# EAGLE design Rear Lamp (EAGLE 8.2.2)
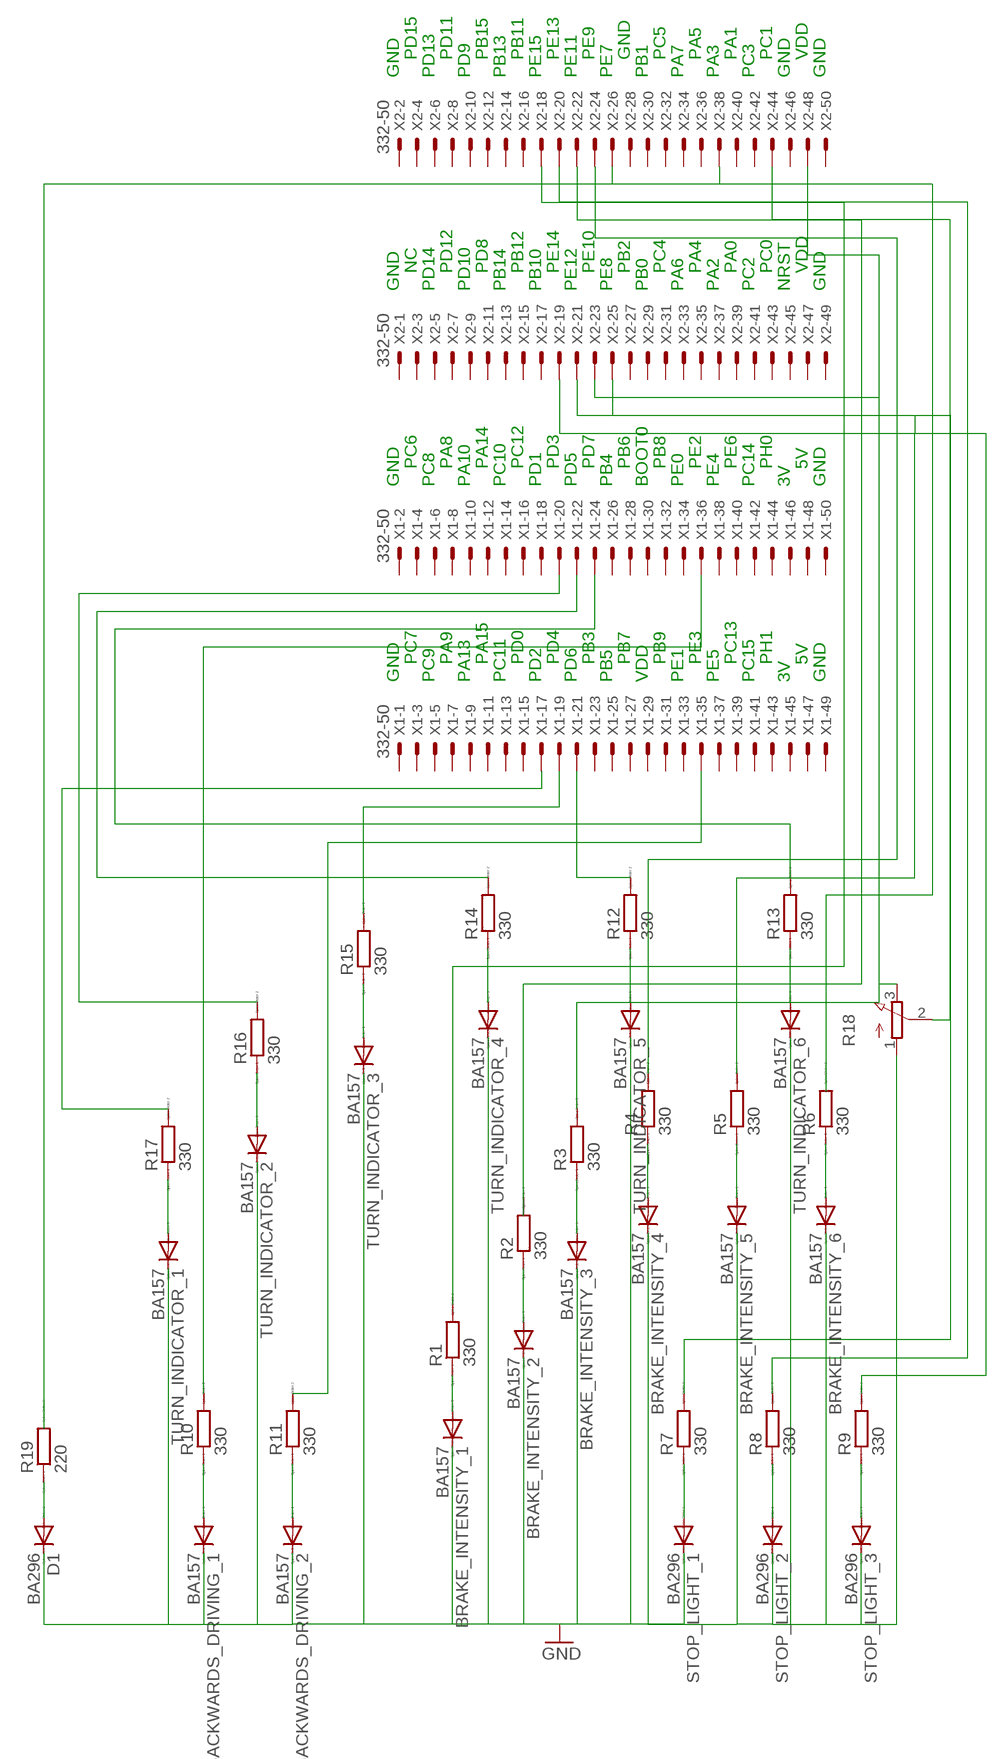
[diagram p0: schematic, sheet 1]

## Parts
BACKWARDS_DRIVING_1  BA157  [P1-10]
BACKWARDS_DRIVING_2  BA157  [P1-10]
BRAKE_INTENSITY_1  BA157  [P1-10]
BRAKE_INTENSITY_2  BA157  [P1-10]
BRAKE_INTENSITY_3  BA157  [P1-10]
BRAKE_INTENSITY_4  BA157  [P1-10]
BRAKE_INTENSITY_5  BA157  [P1-10]
BRAKE_INTENSITY_6  BA157  [P1-10]
D1  BA296  [P2-15]
R1  330  R0204/7  [0204/7]
R2  330  R0204/7  [0204/7]
R3  330  R0204/7  [0204/7]
R4  330  R0204/7  [0204/7]
R5  330  R0204/7  [0204/7]
R6  330  R0204/7  [0204/7]
R7  330  R0204/7  [0204/7]
R8  330  R0204/7  [0204/7]
R9  330  R0204/7  [0204/7]
R10  330  R0204/7  [0204/7]
R11  330  R0204/7  [0204/7]
R12  330  R0204/7  [0204/7]
R13  330  R0204/7  [0204/7]
R14  330  R0204/7  [0204/7]
R15  330  R0204/7  [0204/7]
R16  330  R0204/7  [0204/7]
R17  330  R0204/7  [0204/7]
R18  3RP/1610N  [3RP/1610N]
R19  220  R0204/7  [0204/7]
STOP_LIGHT_1  BA296  [P2-15]
STOP_LIGHT_2  BA296  [P2-15]
STOP_LIGHT_3  BA296  [P2-15]
TURN_INDICATOR_1  BA157  [P1-10]
TURN_INDICATOR_2  BA157  [P1-10]
TURN_INDICATOR_3  BA157  [P1-10]
TURN_INDICATOR_4  BA157  [P1-10]
TURN_INDICATOR_5  BA157  [P1-10]
TURN_INDICATOR_6  BA157  [P1-10]
X1  332-50  [332-50]
X2  332-50  [332-50]

## Nets
N$1: BRAKE_INTENSITY_1.A R1.1
N$2: BRAKE_INTENSITY_2.A R2.1
N$3: BRAKE_INTENSITY_3.A R3.1
N$4: BRAKE_INTENSITY_4.A R4.1
N$5: BRAKE_INTENSITY_5.A R5.1
N$6: BRAKE_INTENSITY_6.A R6.1
N$7: R7.1 STOP_LIGHT_1.A
N$8: R8.1 STOP_LIGHT_2.A
N$9: R9.1 STOP_LIGHT_3.A
N$10: BACKWARDS_DRIVING_1.A R10.1
N$11: BACKWARDS_DRIVING_2.A R11.1
N$12: R12.1 TURN_INDICATOR_5.A
N$13: R13.1 TURN_INDICATOR_6.A
N$14: R14.1 TURN_INDICATOR_4.A
N$15: R15.1 TURN_INDICATOR_3.A
N$16: R16.1 TURN_INDICATOR_2.A
N$17: R17.1 TURN_INDICATOR_1.A
N$18: R17.2 X1.17
N$19: D1.A R19.1
N$20: R16.2 X1.20
N$21: R15.2 X1.19
N$22: R14.2 X1.22
N$23: R12.2 X1.21
N$24: R13.2 X1.24
N$25: R10.2 X1.36
N$26: R11.2 X1.35
N$27: X2.38
N$28: R1.2 X2.18
N$29: X2.22
N$30: X2.26
N$31: R3.2 X2.23
N$32: R4.2 X2.24
N$33: R5.2 X2.25
N$34: R7.2 X2.21
N$35: R8.2 X2.20
N$36: R9.2 X2.19
N$37: R18.2(S) X2.44
N$38: R18.3(E) X2.48
N$39: BACKWARDS_DRIVING_1.C BACKWARDS_DRIVING_2.C BRAKE_INTENSITY_1.C BRAKE_INTENSITY_2.C BRAKE_INTENSITY_3.C BRAKE_INTENSITY_4.C BRAKE_INTENSITY_5.C BRAKE_INTENSITY_6.C D1.C R18.1(A) STOP_LIGHT_1.C STOP_LIGHT_2.C STOP_LIGHT_3.C TURN_INDICATOR_1.C TURN_INDICATOR_2.C TURN_INDICATOR_3.C TURN_INDICATOR_4.C TURN_INDICATOR_5.C TURN_INDICATOR_6.C
Unconnected: R2.2 R6.2 R19.2 X1.1 X1.2 X1.3 X1.4 X1.5 X1.6 X1.7 X1.8 X1.9 X1.10 X1.11 X1.12 X1.13 X1.14 X1.15 X1.16 X1.18 X1.23 X1.25 X1.26 X1.27 X1.28 X1.29 X1.30 X1.31 X1.32 X1.33 X1.34 X1.37 X1.38 X1.39 X1.40 X1.41 X1.42 X1.43 X1.44 X1.45 X1.46 X1.47 X1.48 X1.49 X1.50 X2.1 X2.2 X2.3 X2.4 X2.5 X2.6 X2.7 X2.8 X2.9 X2.10 X2.11 X2.12 X2.13 X2.14 X2.15 X2.16 X2.17 X2.27 X2.28 X2.29 X2.30 X2.31 X2.32 X2.33 X2.34 X2.35 X2.36 X2.37 X2.39 X2.40 X2.41 X2.42 X2.43 X2.45 X2.46 X2.47 X2.49 X2.50

## Notes on the sheet
- PD15 | PD11 | PB15 | PB11 | PE13 | PE9 | GND | PC5 | PA5 | PA1 | PC1 | VDD
- GND | PD13 | PD9 | PB13 | PE15 | PE11 | PE7 | PB1 | PA7 | PA3 | PC3 | GND | GND
- NC | PD12 | PD8 | PB12 | PE14 | PE10 | PB2 | PC4 | PA4 | PA0 | PC0 | VDD
- GND | PD14 | PD10 | PB14 | PB10 | PE12 | PE8 | PB0 | PA6 | PA2 | PC2 | NRST | GND
- PC6 | PA8 | PA14 | PC12 | PD3 | PD7 | PB6 | PB8 | PE2 | PE6 | PH0 | 5V
- GND | PC8 | PA10 | PC10 | PD1 | PD5 | PB4 | BOOT0 | PE0 | PE4 | PC14 | 3V | GND
- PC7 | PA9 | PA15 | PD0 | PD4 | PB3 | PB7 | PB9 | PE3 | PC13 | PH1 | 5V
- GND | PC9 | PA13 | PC11 | PD2 | PD6 | PB5 | VDD | PE1 | PE5 | PC15 | 3V | GND

## Library data of the parts
BACKWARDS_DRIVING_1 BACKWARDS_DRIVING_2 BRAKE_INTENSITY_1-BRAKE_INTENSITY_6 TURN_INDICATOR_1-TURN_INDICATOR_6 = diode:BA157: DIODE fast soft-recovery controlled avalanche rectifier
D1 STOP_LIGHT_1-STOP_LIGHT_3 = diode:BA296: DIODE
R1-R17 R19 = eagle-ltspice:R: RESISTOR, European symbol; SPICEMODEL: NONE; SPICEPREFIX: R
R18 = pot:3RP/1610N: 16mm Potentiometer one level Source: http://www.alphapotentiometers.net/html/16mm_pot_2.html
X1 X2 = con-garry:332-50: 50 Pin - 2mm Dual Row Source: www.mpe-connector.de / garry_shortform_2012.pdf

## Board
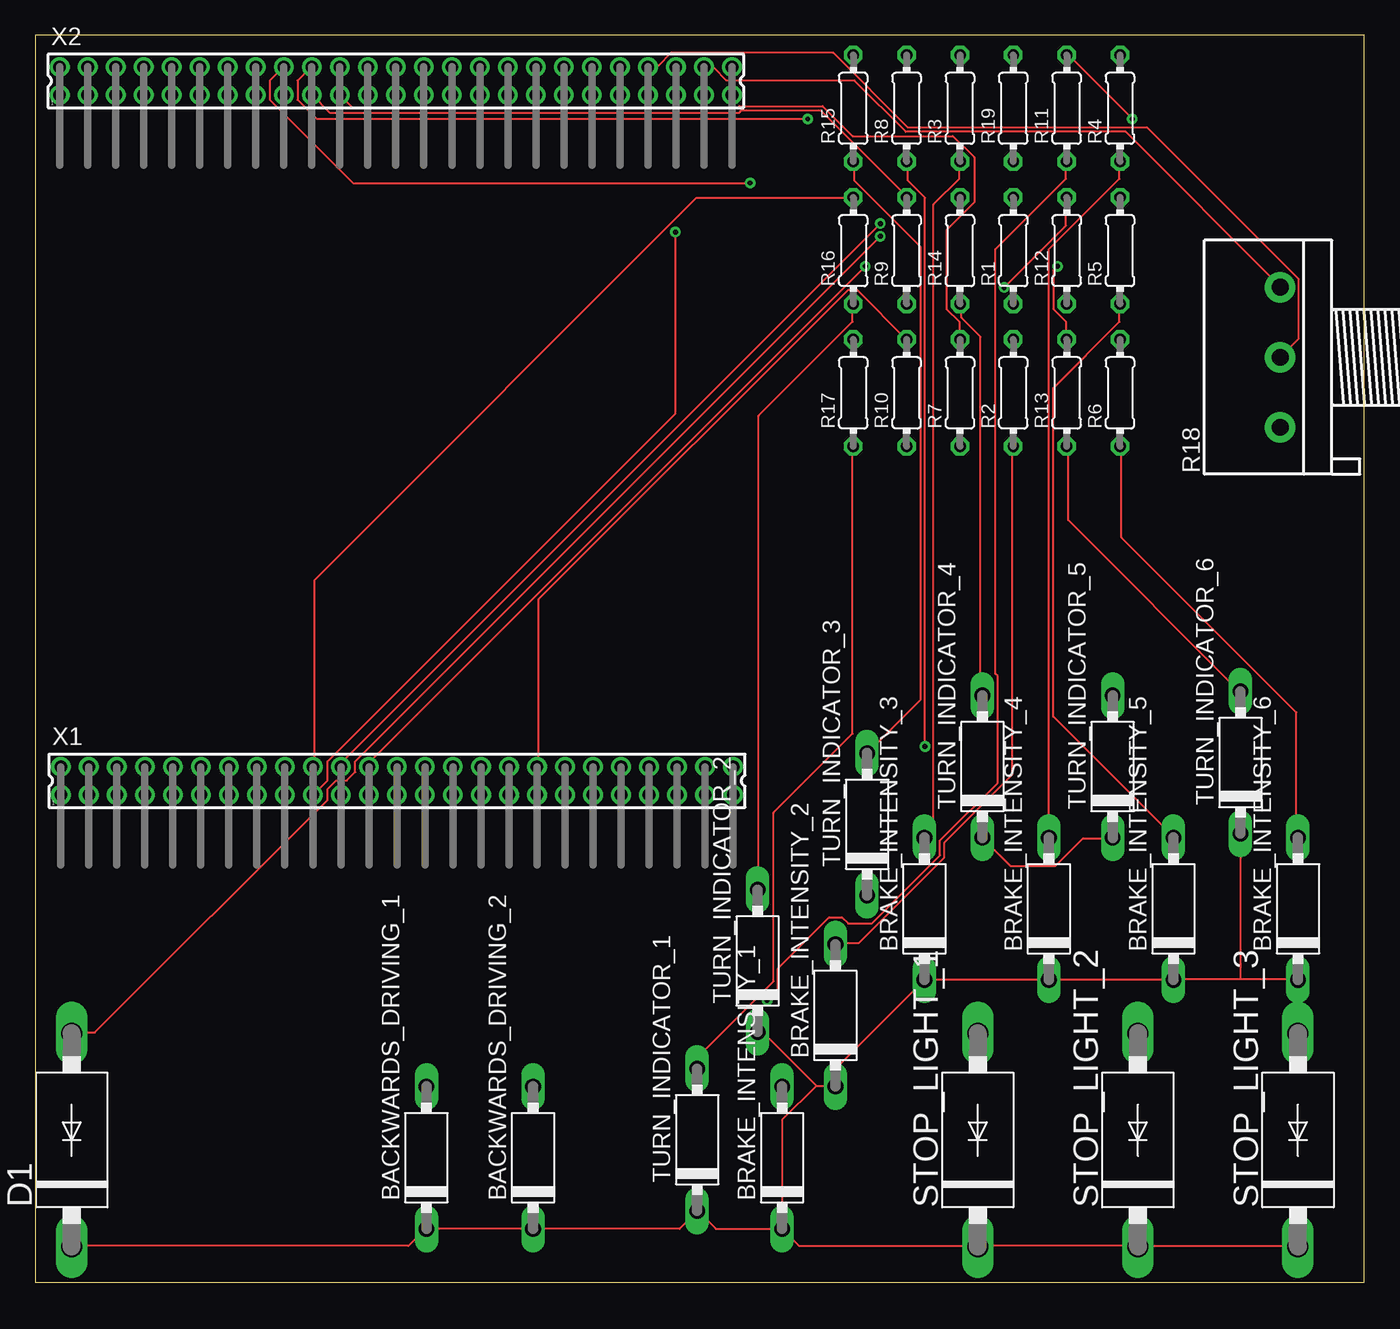
[diagram p1: board, top side]
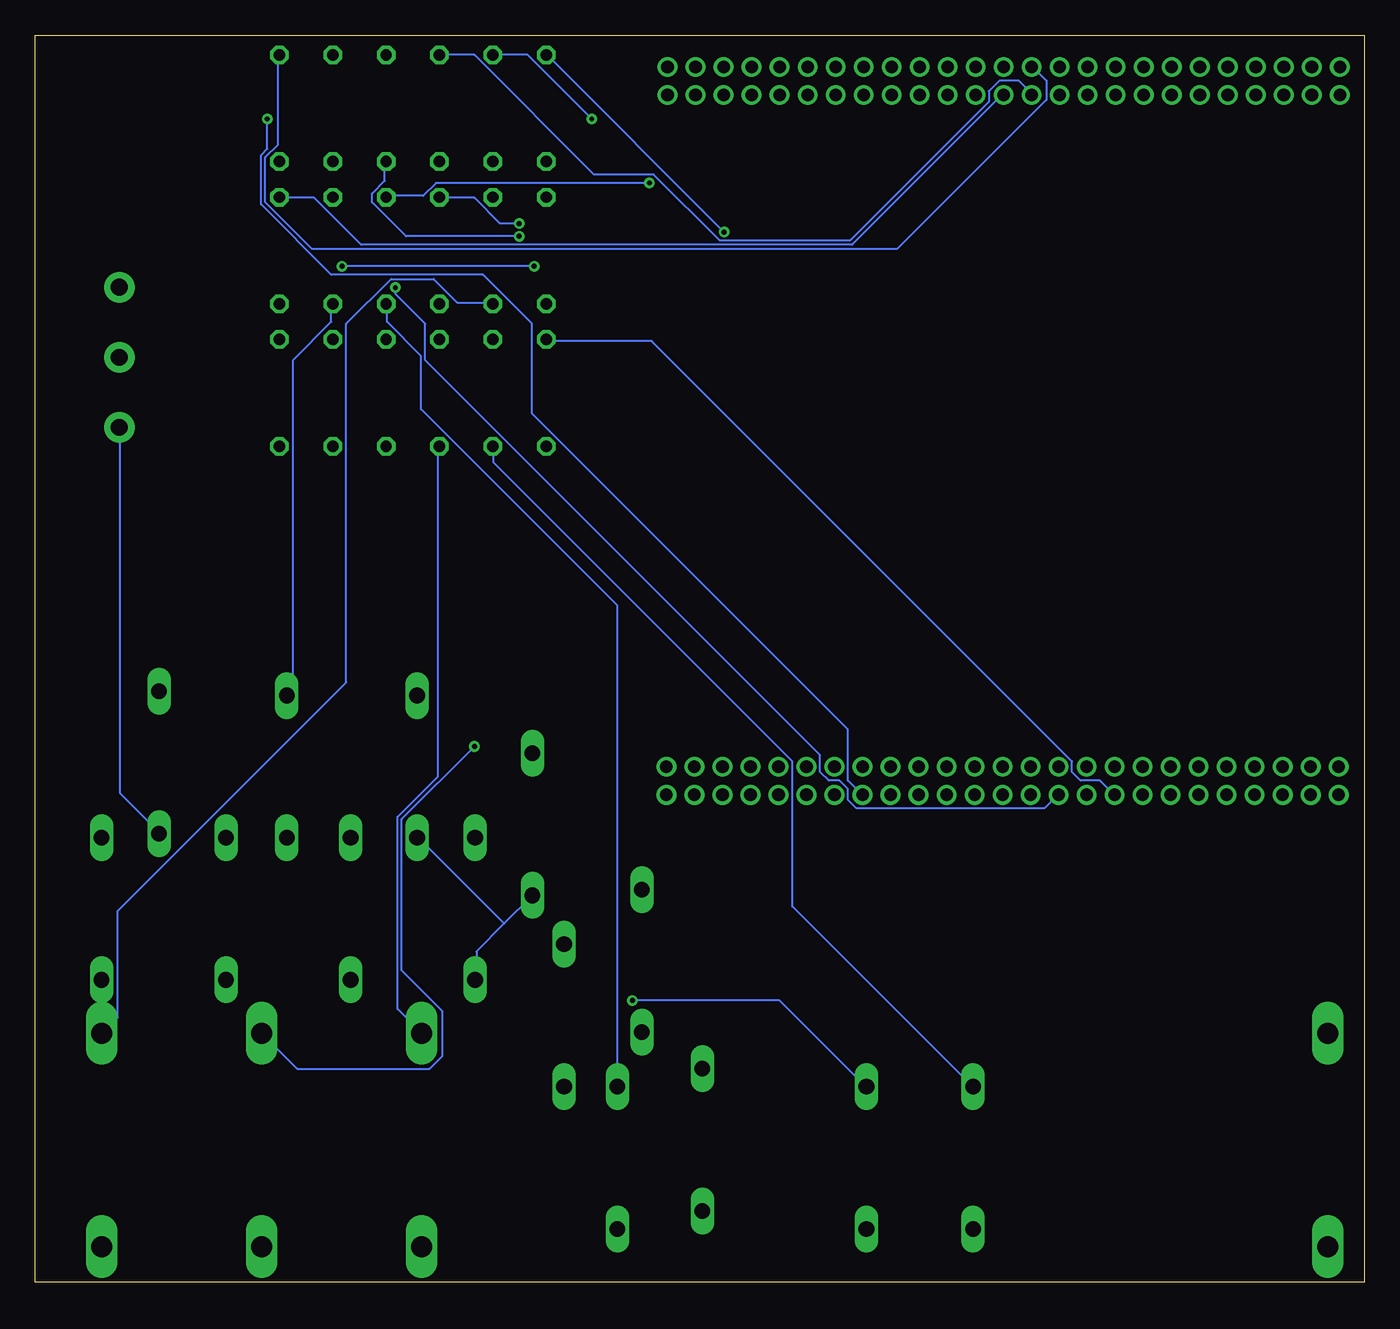
[diagram p2: board, bottom side, seen from below]

Size 94.92 x 89.05 mm. Coordinates in mm from the lower left corner, seen from the top.
Outline: 0,0 94.92,0 94.92,89.05 0,89.05 0,0
Copper layers (1*16): Top 0.035mm / dielectric 1.5mm / Bottom 0.035mm
Design rules "default": minimum track width 6mil, minimum drill 0.35mm, track to track 6mil, track to pad 6mil, pad to pad 6mil, via to via 6mil, smd to smd 6mil, copper to edge 40mil, drill to drill 6mil, minimum pad ring 10mil, minimum via ring 8mil, stop-mask expansion 4mil, vias tented up to drill 0mil, thermal gap 10mil

### Footprints (pad centres in the part's own frame; a part is rotated, then mirrored left to right if it is on the bottom)
P1-10 = drill 1.118 long: A 5.08,0; C -5.08,0
P2-15 = drill 1.499 long: A 7.62,0; C -7.62,0
0204/7 = drill 0.813 octagon: 1 -3.81,0; 2 3.81,0
3RP/1610N = drill 1.2 pad 2.184: 1 -5,0; 2 0,0; 3 5,0
332-50 = drill 0.9 pad 1.27: 1 -24,-1; 2 -24,1; 3 -22,-1; 4 -22,1; 5 -20,-1; 6 -20,1; 7 -18,-1; 8 -18,1; 9 -16,-1; 10 -16,1; 11 -14,-1; 12 -14,1; 13 -12,-1; 14 -12,1; 15 -10,-1; 16 -10,1; 17 -8,-1; 18 -8,1; 19 -6,-1; 20 -6,1; 21 -4,-1; 22 -4,1; 23 -2,-1; 24 -2,1; 25 0,-1; 26 0,1; 27 2,-1; 28 2,1; 29 4,-1; 30 4,1; 31 6,-1; 32 6,1; 33 8,-1; 34 8,1; 35 10,-1; 36 10,1; 37 12,-1; 38 12,1; 39 14,-1; 40 14,1; 41 16,-1; 42 16,1; 43 18,-1; 44 18,1; 45 20,-1; 46 20,1; 47 22,-1; 48 22,1; 49 24,-1; 50 24,1

### Placement (x,y rotation side)
BACKWARDS_DRIVING_1  27.94,8.89 90 top
BACKWARDS_DRIVING_2  35.56,8.89 90 top
BRAKE_INTENSITY_1  53.34,8.89 90 top
BRAKE_INTENSITY_2  57.15,19.05 90 top
BRAKE_INTENSITY_3  63.5,26.67 90 top
BRAKE_INTENSITY_4  72.39,26.67 90 top
BRAKE_INTENSITY_5  81.28,26.67 90 top
BRAKE_INTENSITY_6  90.17,26.67 90 top
D1  2.62,10.16 90 top
R1  69.85,73.66 90 top
R2  69.85,63.5 90 top
R3  66.04,83.82 90 top
R4  77.47,83.82 90 top
R5  77.47,73.66 90 top
R6  77.47,63.5 90 top
R7  66.04,63.5 90 top
R8  62.23,83.82 90 top
R9  62.23,73.66 90 top
R10  62.23,63.5 90 top
R11  73.66,83.82 90 top
R12  73.66,73.66 90 top
R13  73.66,63.5 90 top
R14  66.04,73.66 90 top
R15  58.42,83.82 90 top
R16  58.42,73.66 90 top
R17  58.42,63.5 90 top
R18  88.9,66.04 90 top
R19  69.85,83.82 90 top
STOP_LIGHT_1  67.31,10.16 90 top
STOP_LIGHT_2  78.74,10.16 90 top
STOP_LIGHT_3  90.17,10.16 90 top
TURN_INDICATOR_1  47.28,10.17 90 top
TURN_INDICATOR_2  51.59,22.94 90 top
TURN_INDICATOR_3  59.41,32.7 90 top
TURN_INDICATOR_4  67.64,36.81 90 top
TURN_INDICATOR_5  76.94,36.81 90 top
TURN_INDICATOR_6  86.07,37.11 90 top
X1  25.84,35.8 0 top
X2  25.76,85.77 0 top

### Tracks (layer width: path | path; a pad name or v marks a point on that pad's centre or on a via)
N$1
  Bottom 0.152: BRAKE_INTENSITY_1.A 53.34,48.31 67.36,62.33 67.36,66.14 69.8,68.58 69.8,69.8 R1.1
N$2
  Top 0.152: R2.1 69.8,59.59 69.8,36.27 64.92,31.39 64.92,30.33 58.83,24.23 57.15,24.23 BRAKE_INTENSITY_2.A
N$3
  Top 0.152: R3.1 65.99,80.01 65.99,78.79 64.16,76.96 64.16,32.46 63.55,31.85 BRAKE_INTENSITY_3.A
N$4
  Top 0.152: BRAKE_INTENSITY_4.A 72.39,73.76 77.42,78.79 77.42,80.01 R4.1
N$5
  Top 0.152: R5.1 77.42,69.8 77.42,68.58 72.69,63.86 72.69,40.39 81.23,31.85 BRAKE_INTENSITY_5.A
N$6
  Top 0.152: R6.1 77.57,59.59 77.57,53.19 90.07,40.69 90.07,31.85 BRAKE_INTENSITY_6.A
N$7
  Bottom 0.152: STOP_LIGHT_1.A 69.04,19.51 69.04,33.22 66.14,36.12 66.14,59.59 R7.1
N$8  (via drill 0.35)
  Top 0.152: v63.55,38.25 63.55,77.42 62.33,78.64 62.33,80.01 R8.1
  Bottom 0.152: v63.55,38.25 68.73,33.07 68.73,22.25 65.84,19.36 65.84,16.15 66.75,15.24 76.2,15.24 STOP_LIGHT_2.A
N$9
  Bottom 0.152: R9.1 62.33,69.95 64.77,69.95 66.45,71.63 69.49,71.63 72.69,68.43 72.69,42.82 89,26.52 89,18.9 90.07,17.83 STOP_LIGHT_3.A
N$10
  Bottom 0.152: R10.1 62.18,59.59 62.18,58.52 40.84,37.19 40.84,26.82 28.04,14.02 BACKWARDS_DRIVING_1.A
N$11  (via drill 0.35)
  Top 0.152: v52.27,20.12 53.03,20.88 53.03,22.4 56.69,26.06 57.61,26.06 58.06,25.6 59.74,25.6 64.62,30.48 64.62,31.55 68.73,35.66 68.73,43.28 68.58,43.43 68.58,73.76 73.61,78.79 73.61,80.01 R11.1
  Bottom 0.152: v52.27,20.12 41.76,20.12 35.66,14.02 BACKWARDS_DRIVING_2.A
N$12
  Bottom 0.152: R12.1 73.76,69.8 73.76,68.58 76.5,65.84 76.5,42.22 76.81,41.91 TURN_INDICATOR_5.A
N$13
  Top 0.152: R13.1 73.76,59.59 73.76,54.41 85.95,42.22 TURN_INDICATOR_6.A
N$14
  Top 0.152: R14.1 66.14,69.8 66.14,68.89 67.51,67.51 67.51,41.91 TURN_INDICATOR_4.A
N$15
  Top 0.152: R15.1 58.52,80.01 58.52,78.64 63.25,73.91 63.25,41.6 59.44,37.8 TURN_INDICATOR_3.A
N$16
  Top 0.152: R16.1 58.37,69.8 58.37,68.58 51.66,61.87 51.66,28.04 TURN_INDICATOR_2.A
N$17
  Top 0.152: R17.1 58.37,59.59 58.37,39.17 52.73,33.53 52.73,21.49 47.4,16.15 47.4,15.39 TURN_INDICATOR_1.A
N$18
  Bottom 0.152: R17.2 58.37,67.21 50.9,67.21 20.88,37.19 20.88,36.42 20.27,35.81 18.9,35.81 17.98,34.9 X1.17
N$19  (via drill 0.35)
  Top 0.152: v60.35,74.68 22.86,37.19 22.86,36.42 22.25,35.81 21.49,35.81 20.88,35.2 20.88,34.44 4.27,17.83 2.74,17.83 D1.A
  Bottom 0.152: v60.35,74.68 68.43,74.68 70.87,77.11 70.87,77.72 69.95,78.64 69.95,80.01 R19.1
N$20
  Top 0.152: R16.2 58.37,77.42 47.24,77.42 19.96,50.14 19.96,36.88 X1.20
N$21  (via drill 0.35)
  Top 0.152: v45.72,74.98 45.72,62.03 20.88,37.19 20.88,35.81 19.96,34.9 X1.19
  Bottom 0.152: v45.72,74.98 58.37,87.63 R15.2
N$22  (via drill 0.35)
  Top 0.152: v60.35,75.59 21.95,37.19 21.95,36.88 X1.22
  Bottom 0.152: v60.35,75.59 61.72,75.59 63.55,77.42 65.99,77.42 R14.2
N$23  (via drill 0.35)
  Top 0.152: v69.19,71.02 73.61,75.44 73.61,77.42 R12.2
  Bottom 0.152: v69.19,71.02 69.19,70.56 67.06,68.43 67.06,65.84 38.86,37.64 38.86,36.42 38.25,35.81 37.49,35.81 36.88,35.2 36.88,34.44 36.27,33.83 22.86,33.83 21.95,34.75 X1.21
N$24  (via drill 0.35)
  Top 0.152: v73,72.54 72.69,72.24 72.69,69.49 73.61,68.58 73.61,67.36 R13.2 | v59.28,72.54 23.93,37.19 23.93,36.88 X1.24
  Bottom 0.152: v59.28,72.54 v73,72.54
N$25
  Top 0.152: R10.2 58.67,70.87 58.06,70.87 35.97,48.77 35.97,36.88 X1.36
N$26  (via drill 0.35)
  Top 0.152: v78.33,83.06 73.76,87.63 R11.2
  Bottom 0.152: v78.33,83.06 78.33,80.92 78.79,80.47 78.79,76.96 73.76,71.93 62.94,71.93 59.44,68.43 59.44,62.03 36.88,39.47 36.88,35.81 35.97,34.9 X1.35
N$28  (via drill 0.35)
  Top 0.152: v51.05,78.49 22.71,78.49 16.76,84.43 16.76,85.8 17.68,86.72 X2.18
  Bottom 0.152: v51.05,78.49 66.29,78.49 67.21,77.57 69.8,77.57 R1.2
N$31
  Bottom 0.152: R3.2 63.55,87.63 55.02,79.1 50.75,79.1 46.02,74.37 36.73,74.37 26.82,84.28 26.82,85.04 26.06,85.8 24.69,85.8 23.77,84.89 X2.23
N$32
  Bottom 0.152: R4.2 77.57,87.63 77.57,81.23 78.49,80.31 78.49,77.11 75.13,73.76 33.38,73.76 22.71,84.43 22.71,85.8 23.62,86.72 X2.24
N$33
  Bottom 0.152: R5.2 77.42,77.42 74.98,77.42 71.63,74.07 36.58,74.07 25.91,84.73 X2.25
N$34
  Top 0.152: R7.2 65.99,67.36 65.99,68.58 65.08,69.49 65.08,75.13 67.06,77.11 67.06,80.31 65.53,81.84 58.37,81.84 56.24,83.97 50.29,83.97 50.14,83.82 22.71,83.82 21.79,84.73 X2.21
N$35  (via drill 0.35)
  Top 0.152: v55.17,83.06 20.12,83.06 18.75,84.43 18.75,85.8 19.66,86.72 X2.20
  Bottom 0.152: R8.2 59.74,87.63 v55.17,83.06
N$36
  Top 0.152: R9.2 62.18,77.57 56.08,83.67 50.44,83.67 50.29,83.52 21.03,83.52 19.81,84.73 X2.19
N$37
  Top 0.152: R18.2 90.22,67.36 90.22,71.63 79.4,82.45 62.33,82.45 57,87.78 45.41,87.78 44.5,86.87 43.89,86.87 X2.44
N$38
  Top 0.152: X2.48 47.85,86.72 48.46,86.72 49.38,85.8 58.52,85.8 62.18,82.14 77.88,82.14 88.85,71.17 R18.3
N$39
  Top 0.152: 86.11,21.64 90.07,21.64 BRAKE_INTENSITY_6.C | 86.11,21.64 81.38,21.64 BRAKE_INTENSITY_5.C 81.23,21.64 72.39,21.64 | 86.11,21.64 86.11,32 TURN_INDICATOR_6.C | D1.C 2.74,2.59 26.67,2.59 27.89,3.81 BACKWARDS_DRIVING_1.C BACKWARDS_DRIVING_2.C 46.02,3.81 47.24,5.03 TURN_INDICATOR_1.C 47.4,5.03 48.62,3.81 BRAKE_INTENSITY_1.C | STOP_LIGHT_3.C 90.07,2.59 78.79,2.59 STOP_LIGHT_2.C 78.64,2.59 67.36,2.59 STOP_LIGHT_1.C 67.21,2.59 54.56,2.59 BRAKE_INTENSITY_1.C | 55.78,14.02 57.15,14.02 | 55.78,14.02 51.97,17.83 51.66,17.83 TURN_INDICATOR_2.C | BRAKE_INTENSITY_1.C 53.34,11.58 55.78,14.02 | 72.39,21.64 63.55,21.64 BRAKE_INTENSITY_3.C 57.15,15.24 57.15,14.02 | TURN_INDICATOR_5.C 76.81,31.7 74.83,31.7 72.85,29.72 69.65,29.72 67.67,31.7 TURN_INDICATOR_4.C | 57.15,14.02 BRAKE_INTENSITY_2.C | 72.39,21.64 BRAKE_INTENSITY_4.C
  Bottom 0.152: R18.1 88.85,60.96 88.85,34.9 86.11,32.16 TURN_INDICATOR_6.C | 61.42,25.6 59.44,27.58 TURN_INDICATOR_3.C | 61.42,25.6 63.4,23.62 63.4,21.64 BRAKE_INTENSITY_3.C | 61.42,25.6 67.51,31.7 TURN_INDICATOR_4.C